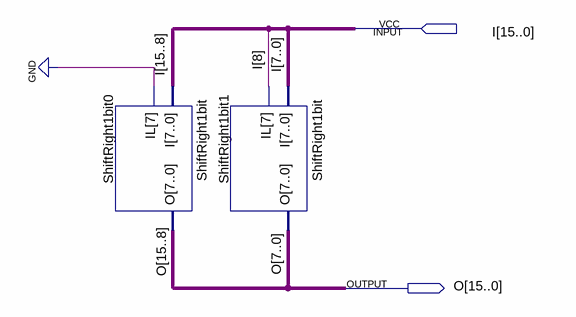
[diagram p0: schematic sheet]
// Quartus schematic ShiftRight1_16bit.bdf as structural Verilog: 2 symbols, 2 pins
module ShiftRight1_16bit (
  input  [15:0] I,
  output [15:0] O
);

  ShiftRight1bit ShiftRight1bit0 (.I(I[15:8]), .IL(1'b0), .O(O[15:8]));
  ShiftRight1bit ShiftRight1bit1 (.I(I[7:0]), .IL(I[8]), .O(O[7:0]));
endmodule
